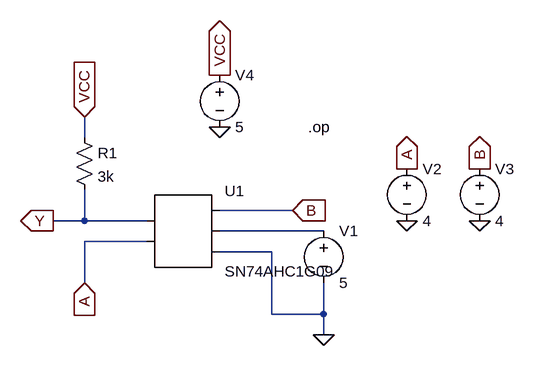
[diagram p0: schematic SN74AHC1G09 (AND).asc]
SN74AHC1G09 (AND).asc, the LTspice schematic file:
Version 4
SHEET 1 940 680
WIRE 272 160 272 128
WIRE 592 272 480 272
WIRE 272 288 272 240
WIRE 272 288 224 288
WIRE 368 288 272 288
WIRE 640 304 480 304
WIRE 368 320 272 320
WIRE 560 336 480 336
WIRE 272 384 272 320
WIRE 560 432 560 336
WIRE 640 432 640 384
WIRE 640 432 560 432
WIRE 640 464 640 432
FLAG 640 464 0
FLAG 272 384 A
IOPIN 272 384 In
FLAG 592 272 B
IOPIN 592 272 In
FLAG 768 208 A
IOPIN 768 208 Out
FLAG 880 208 B
IOPIN 880 208 Out
FLAG 768 288 0
FLAG 880 288 0
FLAG 224 288 Y
IOPIN 224 288 Out
FLAG 272 128 VCC
IOPIN 272 128 In
FLAG 480 64 VCC
IOPIN 480 64 Out
FLAG 480 144 0
SYMBOL AutoGenerated/SN74AHC1G09 416 304 R0
SYMATTR InstName U1
SYMBOL voltage 640 288 R0
SYMATTR InstName V1
SYMATTR Value 5
SYMBOL voltage 768 192 R0
SYMATTR InstName V2
SYMATTR Value 4
SYMBOL voltage 880 192 R0
SYMATTR InstName V3
SYMATTR Value 4
SYMBOL voltage 480 48 R0
SYMATTR InstName V4
SYMATTR Value 5
SYMBOL res 256 144 R0
SYMATTR InstName R1
SYMATTR Value 3k
TEXT 616 144 Left 2 !.op

The netlist it stands for:
* SN74AHC1G09 (AND).asc
* U1: SN74AHC1G09 (symbol AutoGenerated/SN74AHC1G09 not available, pins judged from their places): pin1=Y pin2=A pin3=B pin4=N001 pin5=0
V1 N001 0 5
V2 A 0 4
V3 B 0 4
V4 VCC 0 5
R1 VCC Y 3k
.op
.backanno
.end